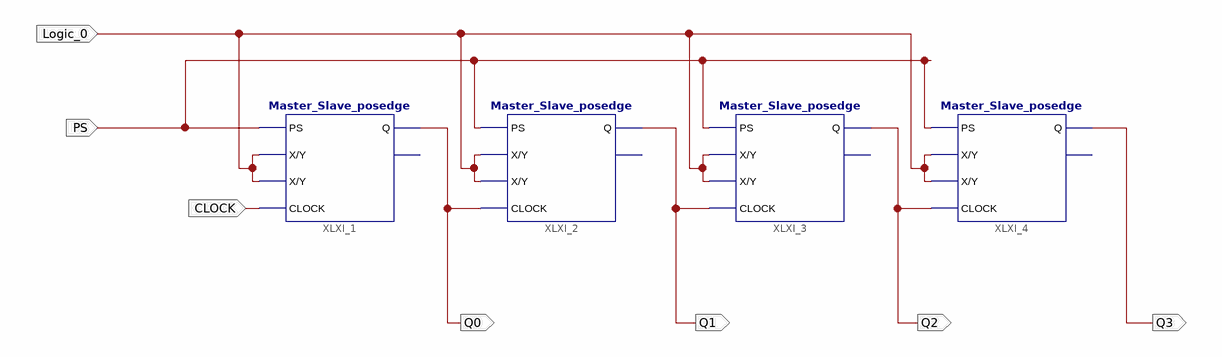
[diagram p0: schematic sheet 1]
// Xilinx ISE schematic Four_Bit_Down_Counter.sch (artix7) as structural Verilog: 4 symbols, 7 ports
module Four_Bit_Down_Counter (
  input  Logic_0,
  input  CLOCK,
  input  PS,
  output Q0,
  output Q1,
  output Q2,
  output Q3
);

  Master_Slave_posedge XLXI_1 (.CLOCK(CLOCK), .PS(PS), .Q(Q0), .X(Logic_0), .Y(Logic_0));  // open: Qb
  Master_Slave_posedge XLXI_2 (.CLOCK(Q0), .PS(PS), .Q(Q1), .X(Logic_0), .Y(Logic_0));  // open: Qb
  Master_Slave_posedge XLXI_3 (.CLOCK(Q1), .PS(PS), .Q(Q2), .X(Logic_0), .Y(Logic_0));  // open: Qb
  Master_Slave_posedge XLXI_4 (.CLOCK(Q2), .PS(PS), .Q(Q3), .X(Logic_0), .Y(Logic_0));  // open: Qb
endmodule
